# EAGLE design TA_2 (EAGLE 9.6.2)
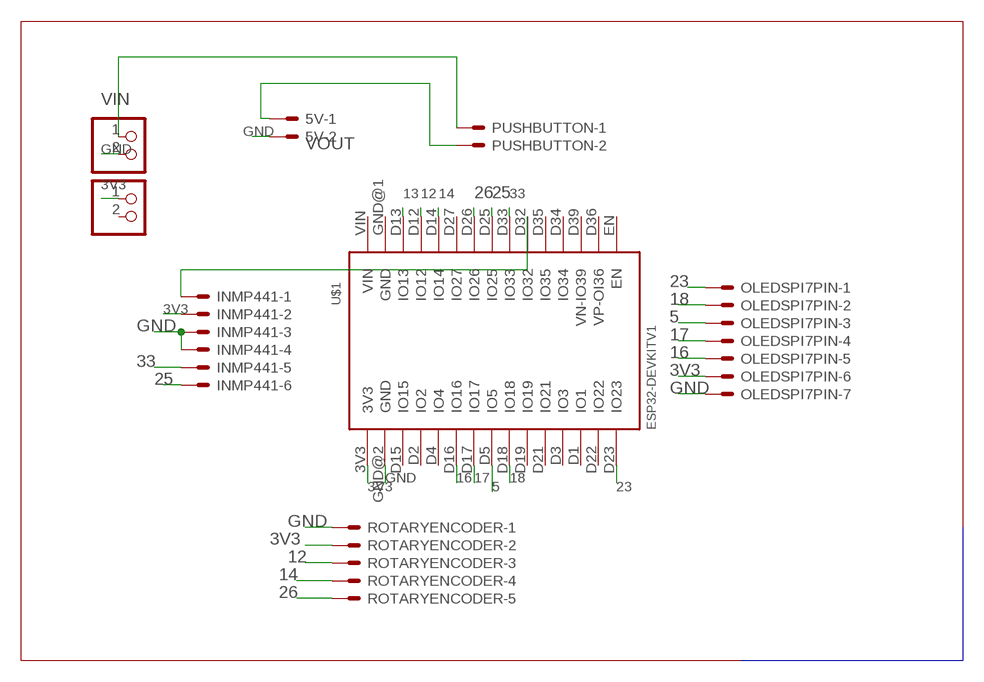
[diagram p0: schematic, sheet 1]

## Parts
5V  JST-XH-02-PIN-LONG-PAD  [JST-XH-02-PACKAGE-LONG-PAD]
INMP441  JST-XH-06-PIN-LONG-PAD  [JST-XH-06-PACKAGE-LONG-PAD]
OLEDSPI7PIN  JST-XH-07-PIN-LONG-PAD  [JST-XH-07-PACKAGE-LONG-PAD]
PUSHBUTTON  JST-XH-02-PIN-LONG-PAD  [JST-XH-02-PACKAGE-LONG-PAD]
ROTARYENCODER  JST-XH-05-PIN-LONG-PAD  [JST-XH-05-PACKAGE-LONG-PAD]
U$1  ESP32DEVKITV1  [ESP32-DEVKITV1]
VIN  PINHD-1X2  [1X02]
VOUT  PINHD-1X2  [1X02]

## Nets
3V3: INMP441.2 OLEDSPI7PIN.6 ROTARYENCODER.2 U$1.3V3 VOUT.1
5: OLEDSPI7PIN.3 U$1.D5(IO5)
12: ROTARYENCODER.3 U$1.D12(IO12)
13: U$1.D13(IO13)
14: ROTARYENCODER.4 U$1.D14(IO14)
16: OLEDSPI7PIN.5 U$1.D16(IO16)
17: OLEDSPI7PIN.4 U$1.D17(IO17)
18: OLEDSPI7PIN.2 U$1.D18(IO18)
23: OLEDSPI7PIN.1 U$1.D23(IO23)
25: INMP441.6 U$1.D25(IO25)
26: ROTARYENCODER.5 U$1.D26(IO26)
33: INMP441.5 U$1.D33(IO33)
GND: 5V.2 INMP441.3 INMP441.4 OLEDSPI7PIN.7 ROTARYENCODER.1 U$1.GND@2(GND) VIN.2
N$1: PUSHBUTTON.1 VIN.1
N$2: 5V.1 PUSHBUTTON.2
N$4: INMP441.1 U$1.D32(IO32)
Unconnected: U$1.D1(IO1) U$1.D2(IO2) U$1.D3(IO3) U$1.D4(IO4) U$1.D15(IO15) U$1.D19(IO19) U$1.D21(IO21) U$1.D22(IO22) U$1.D27(IO27) U$1.D34(IO34) U$1.D35(IO35) U$1.D36(VP-OI36) U$1.D39(VN-IO39) U$1.EN U$1.GND@1(GND) U$1.VIN VOUT.2

## Buses
B$1

## Library data of the parts
5V PUSHBUTTON = Rembrandt Electronics - JST XH Connectors v1-0:JST-XH-02-PIN: JST XH Connector 2 Pin Wire to board connector. Pitch: 2,54 mm, (0.100") Number of pins: 2 Created by Rembrandt Electronics www.rembrandtelectronics.com
INMP441 = Rembrandt Electronics - JST XH Connectors v1-0:JST-XH-06-PIN: JST XH Connector 2 Pin Wire to board connector. Pitch: 2,54 mm, (0.100") Number of pins: 6 Created by Rembrandt Electronics www.rembrandtelectronics.com
OLEDSPI7PIN = Rembrandt Electronics - JST XH Connectors v1-0:JST-XH-07-PIN: JST XH Connector 2 Pin Wire to board connector. Pitch: 2,54 mm, (0.100") Number of pins: 7 Created by Rembrandt Electronics www.rembrandtelectronics.com
ROTARYENCODER = Rembrandt Electronics - JST XH Connectors v1-0:JST-XH-05-PIN: JST XH Connector 2 Pin Wire to board connector. Pitch: 2,54 mm, (0.100") Number of pins: 5 Created by Rembrandt Electronics www.rembrandtelectronics.com
U$1 = ESP32-DEVKITV1:ESP32DEVKITV1
VIN VOUT = pinhead:PINHD-1X2: PIN HEADER

## Board
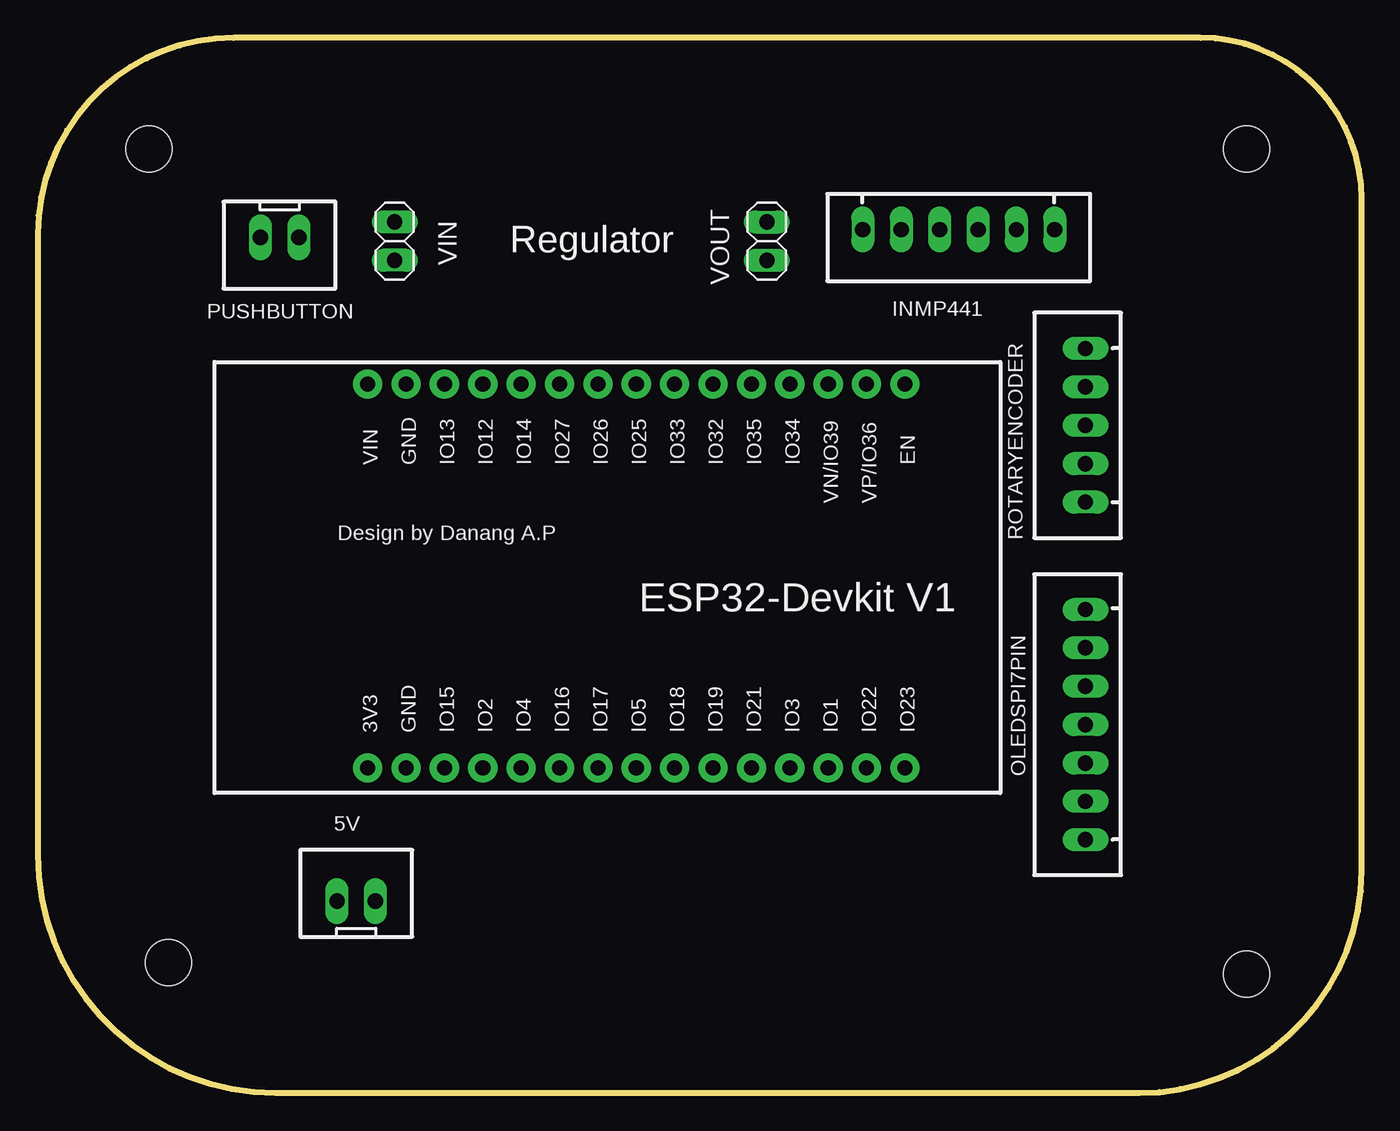
[diagram p1: board, top side]
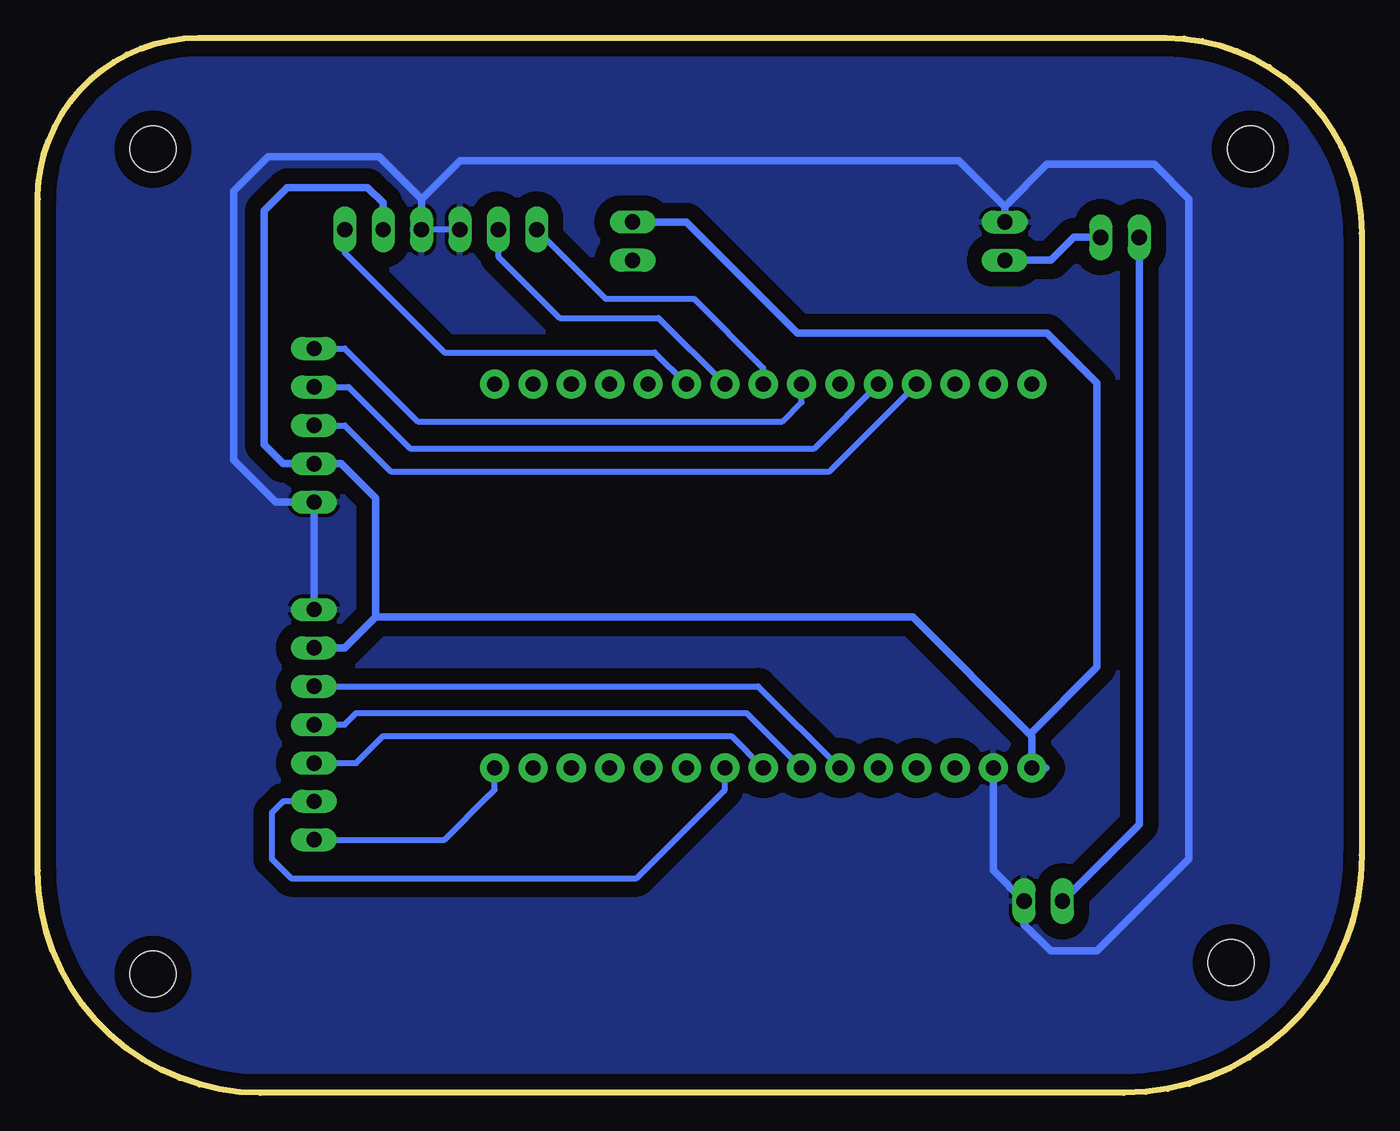
[diagram p2: board, bottom side, seen from below]

Size 87.63 x 69.85 mm. Coordinates in mm from the lower left corner, seen from the top.
Outline: 0,56.9 0,15.75 arc90 15.75,0 72.9,0 arc90 87.63,14.73 87.63,59.18 arc90 76.96,69.85 12.95,69.85 arc90 0,56.9
Copper layers (1*16): Top 0.035mm / dielectric 1.5mm / Bottom 0.035mm
Design rules "default": minimum track width 6mil, minimum drill 0.35mm, track to track 6mil, track to pad 6mil, pad to pad 6mil, via to via 6mil, smd to smd 6mil, copper to edge 40mil, drill to drill 6mil, minimum pad ring 10mil, minimum via ring 8mil, stop-mask expansion 4mil, vias tented up to drill 0mil, thermal gap 10mil
Holes 3.05 mm at 7.37,62.48 80.01,62.48 80.01,7.87 8.64,8.64

### Footprints (pad centres in the part's own frame; a part is rotated, then mirrored left to right if it is on the bottom)
JST-XH-02-PACKAGE-LONG-PAD = drill 1.016 long: 1 -1.27,0; 2 1.27,0
JST-XH-06-PACKAGE-LONG-PAD = drill 1.016 long: 1 -6.35,0; 2 -3.81,0; 3 -1.27,0; 4 1.27,0; 5 3.81,0; 6 6.35,0
JST-XH-07-PACKAGE-LONG-PAD = drill 1.016 long: 1 -7.62,0; 2 -5.08,0; 3 -2.54,0; 4 0,0; 5 2.54,0; 6 5.08,0; 7 7.62,0
JST-XH-05-PACKAGE-LONG-PAD = drill 1.016 long: 1 -5.08,0; 2 -2.54,0; 3 0,0; 4 2.54,0; 5 5.08,0
ESP32-DEVKITV1 = drill 1 pad 1.93: 3V3 -16.52,-12.27; D1 13.96,-12.27; D2 -8.9,-12.27; D3 11.42,-12.27; D4 -6.36,-12.27; D5 1.26,-12.27; D12 -8.9,13.135; D13 -11.44,13.135; D14 -6.36,13.135; D15 -11.44,-12.27; D16 -3.82,-12.27; D17 -1.28,-12.27; D18 3.8,-12.27; D19 6.34,-12.27; D21 8.88,-12.27; D22 16.5,-12.27; D23 19.04,-12.27; D25 1.26,13.135; D26 -1.28,13.135; D27 -3.82,13.135; D32 6.34,13.135; D33 3.8,13.135; D34 11.42,13.135; D35 8.88,13.135; D36 16.5,13.135; D39 13.96,13.135; EN 19.04,13.135; GND@1 -13.98,13.135; GND@2 -13.98,-12.27; VIN -16.52,13.135
1X02 = drill 1.016 long: 1 -1.27,0; 2 1.27,0

### Placement (x,y rotation side)
5V  21.08,12.7 0 top
INMP441  60.96,57.15 180 top
OLEDSPI7PIN  69.34,24.38 90 top
PUSHBUTTON  16,56.64 180 top
ROTARYENCODER  69.34,44.2 90 top
U$1  38.35,33.78 0 top
VIN  23.62,56.39 90 top
VOUT  48.26,56.39 270 top

### Tracks (layer width: path | path; a pad name or v marks a point on that pad's centre or on a via)
3V3
  Bottom 0.508: OLEDSPI7PIN.6 67.31,29.46 65.28,31.5 | 65.28,31.5 65.28,39.37 67.56,41.66 ROTARYENCODER.2 71.37,41.66 72.64,42.93 72.64,58.42 71.12,59.94 65.79,59.94 64.77,58.93 INMP441.2 | VOUT.1 44.7,57.66 37.34,50.29 20.83,50.29 17.53,46.99 17.53,28.19 21.97,23.75 | 20.91,21.51 U$1.3V3 21.83,23.61 21.97,23.75 | 65.28,31.5 29.72,31.5 21.97,23.75
5
  Bottom 0.406: OLEDSPI7PIN.3 66.55,21.84 64.77,23.62 41.72,23.62 U$1.D5
12
  Bottom 0.406: ROTARYENCODER.3 67.31,44.2 64.26,41.15 35.22,41.15 U$1.D12
14
  Bottom 0.406: U$1.D14 36.24,42.67 62.99,42.67 67.06,46.74 ROTARYENCODER.4
16
  Bottom 0.406: OLEDSPI7PIN.5 39.95,26.92 U$1.D16
17
  Bottom 0.406: OLEDSPI7PIN.4 67.31,24.38 66.55,25.15 40.71,25.15 U$1.D17
18
  Bottom 0.406: OLEDSPI7PIN.2 71.37,19.3 72.14,18.54 72.14,15.49 70.87,14.22 48.01,14.22 42.15,20.08 U$1.D18
23
  Bottom 0.406: OLEDSPI7PIN.1 60.71,16.76 57.78,19.69 57.66,19.81 57.39,20.08 U$1.D23
25
  Bottom 0.406: INMP441.6 50.04,52.58 44.2,52.58 39.61,48 U$1.D25
26
  Bottom 0.406: ROTARYENCODER.5 67.31,49.28 62.48,44.45 38.35,44.45 37.07,45.73 U$1.D26
33
  Bottom 0.406: INMP441.5 57.15,55.37 53.09,51.31 46.54,51.31 U$1.D33
GND
  Bottom 0.406: INMP441.4 INMP441.3
  Bottom 0.508: OLEDSPI7PIN.7 ROTARYENCODER.1 71.88,39.12 74.68,41.91 74.68,59.69 72.39,61.98 65.02,61.98 62.23,59.18 | 62.23,59.18 INMP441.3 | VIN.2 23.62,58.67 | 23.62,58.67 26.67,61.72 59.69,61.72 62.23,59.18 | U$1.GND@2 24.37,14.72 5V.2 22.35,11.18 20.57,9.4 17.53,9.4 11.43,15.49 11.43,59.18 13.72,61.47 20.83,61.47 23.62,58.67
  pour Bottom (isolate 1.016): 87.88,59.18 arc90 77.22,69.85 12.7,69.85 arc90 0,57.15 0,15.49 arc90 15.49,0 72.39,0 arc90 87.88,15.49
N$1
  Bottom 0.508: PUSHBUTTON.1 19.05,56.64 20.57,55.12 VIN.1
N$2
  Bottom 0.508: PUSHBUTTON.2 14.73,17.78 5V.1
N$4
  Bottom 0.406: INMP441.1 67.31,55.63 60.71,49.02 46.8,49.02 U$1.D32

### Text on the board
tPlace: Regulator | Design by Danang A.P